# Altium schematic sheet LED fix910 RD 2000278 (4F00224A_7P00494A)_2.SchDoc
size 849 x 241 mm
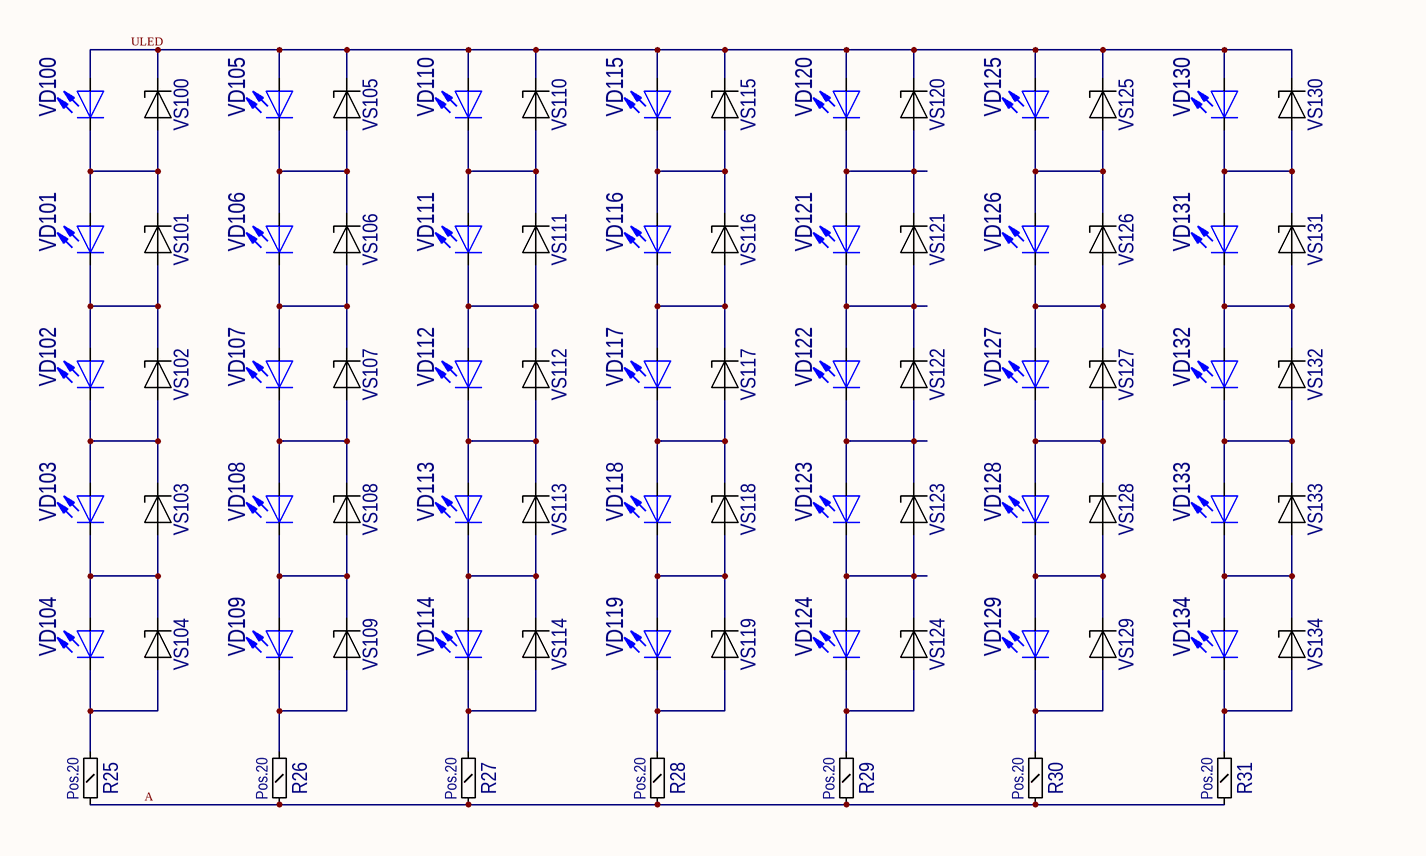
[diagram p0: LED fix910 RD 2000278 (4F00224A_7P00494A)_2.SchDoc, left]
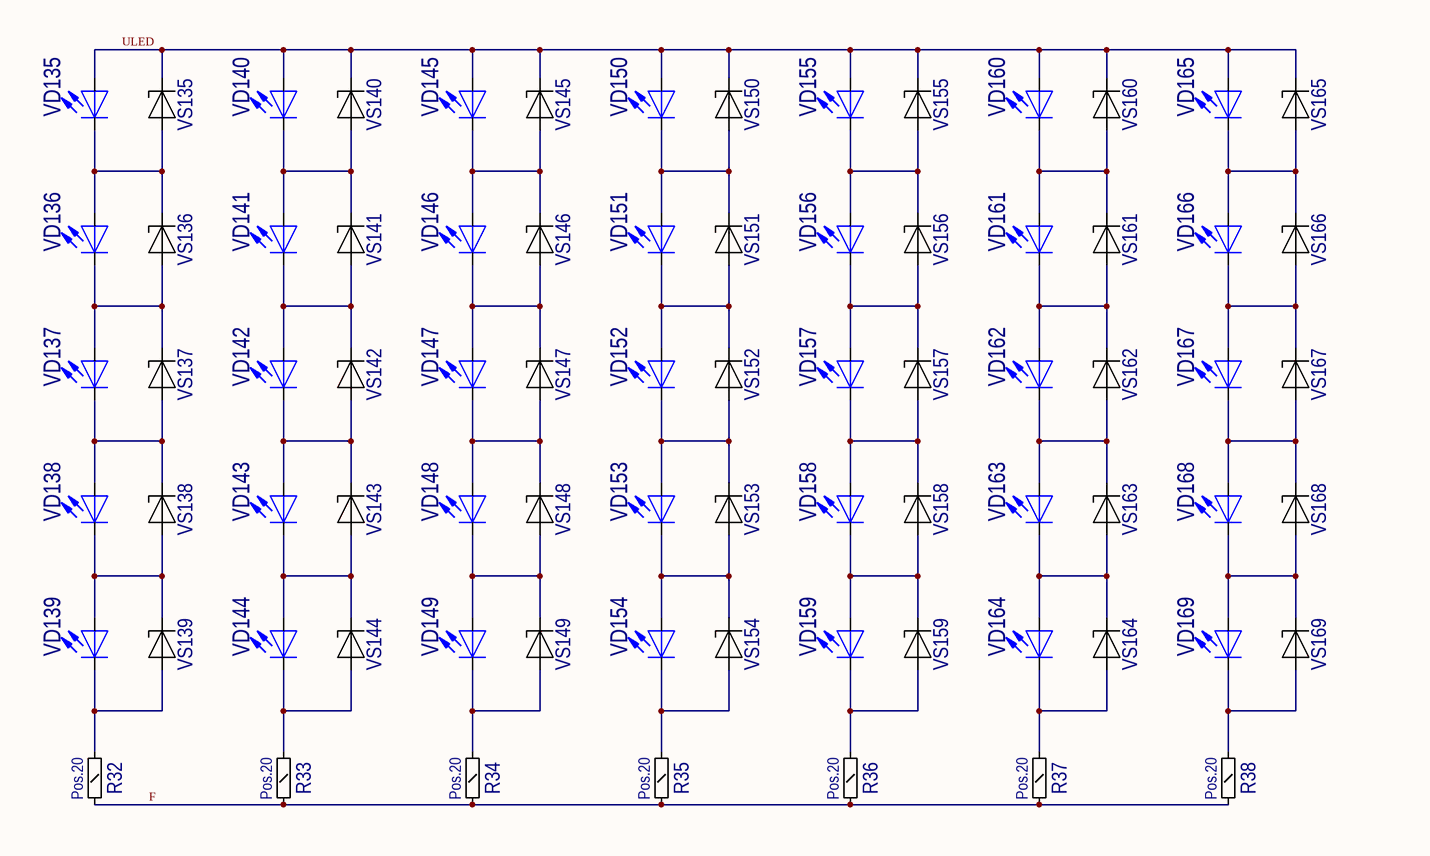
[diagram p1: LED fix910 RD 2000278 (4F00224A_7P00494A)_2.SchDoc, middle]
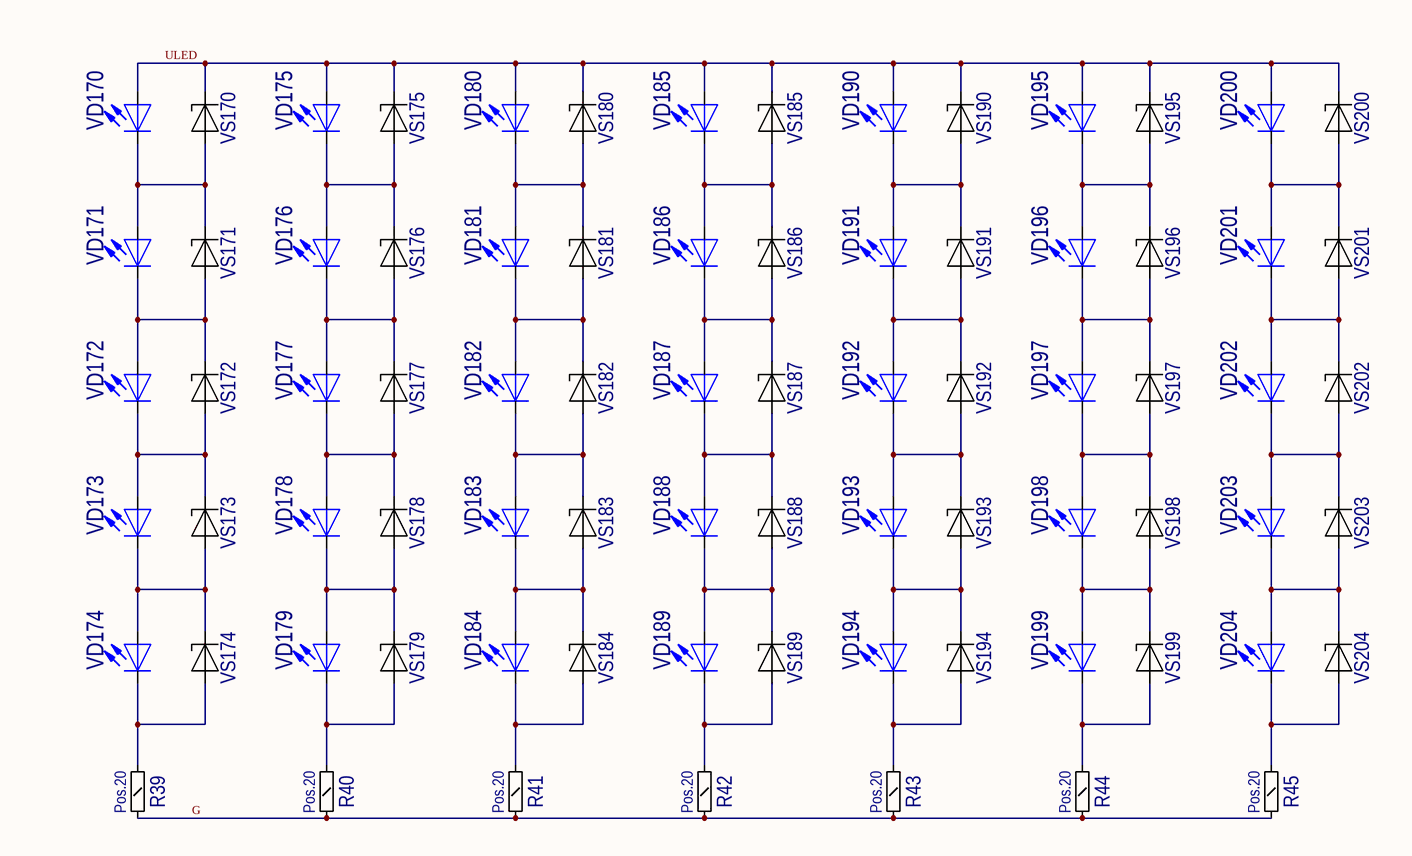
[diagram p2: LED fix910 RD 2000278 (4F00224A_7P00494A)_2.SchDoc, right]

## Parts
R25  value Pos.20  [RC1206S]  (hidden comment: R1206S)
R26  value Pos.20  [RC1206S]  (hidden comment: R1206S)
R27  value Pos.20  [RC1206S]  (hidden comment: R1206S)
R28  value Pos.20  [RC1206S]  (hidden comment: R1206S)
R29  value Pos.20  [RC1206S]  (hidden comment: R1206S)
R30  value Pos.20  [RC1206S]  (hidden comment: R1206S)
R31  value Pos.20  [RC1206S]  (hidden comment: R1206S)
R32  value Pos.20  [RC1206S]  (hidden comment: R1206S)
R33  value Pos.20  [RC1206S]  (hidden comment: R1206S)
R34  value Pos.20  [RC1206S]  (hidden comment: R1206S)
R35  value Pos.20  [RC1206S]  (hidden comment: R1206S)
R36  value Pos.20  [RC1206S]  (hidden comment: R1206S)
R37  value Pos.20  [RC1206S]  (hidden comment: R1206S)
R38  value Pos.20  [RC1206S]  (hidden comment: R1206S)
R39  value Pos.20  [RC1206S]  (hidden comment: R1206S)
R40  value Pos.20  [RC1206S]  (hidden comment: R1206S)
R41  value Pos.20  [RC1206S]  (hidden comment: R1206S)
R42  value Pos.20  [RC1206S]  (hidden comment: R1206S)
R43  value Pos.20  [RC1206S]  (hidden comment: R1206S)
R44  value Pos.20  [RC1206S]  (hidden comment: R1206S)
R45  value Pos.20  [RC1206S]  (hidden comment: R1206S)
VD100  LED, LS E65F-BBDA-1-Z, Red, OSRAM Opto Semiconductors Inc.  [E65F]  (value not drawn)
VD101  LED, LS E65F-BBDA-1-Z, Red, OSRAM Opto Semiconductors Inc.  [E65F]  (value not drawn)
VD102  LED, LS E65F-BBDA-1-Z, Red, OSRAM Opto Semiconductors Inc.  [E65F]  (value not drawn)
VD103  LED, LS E65F-BBDA-1-Z, Red, OSRAM Opto Semiconductors Inc.  [E65F]  (value not drawn)
VD104  LED, LS E65F-BBDA-1-Z, Red, OSRAM Opto Semiconductors Inc.  [E65F]  (value not drawn)
VD105  LED, LS E65F-BBDA-1-Z, Red, OSRAM Opto Semiconductors Inc.  [E65F]  (value not drawn)
VD106  LED, LS E65F-BBDA-1-Z, Red, OSRAM Opto Semiconductors Inc.  [E65F]  (value not drawn)
VD107  LED, LS E65F-BBDA-1-Z, Red, OSRAM Opto Semiconductors Inc.  [E65F]  (value not drawn)
VD108  LED, LS E65F-BBDA-1-Z, Red, OSRAM Opto Semiconductors Inc.  [E65F]  (value not drawn)
VD109  LED, LS E65F-BBDA-1-Z, Red, OSRAM Opto Semiconductors Inc.  [E65F]  (value not drawn)
VD110  LED, LS E65F-BBDA-1-Z, Red, OSRAM Opto Semiconductors Inc.  [E65F]  (value not drawn)
VD111  LED, LS E65F-BBDA-1-Z, Red, OSRAM Opto Semiconductors Inc.  [E65F]  (value not drawn)
VD112  LED, LS E65F-BBDA-1-Z, Red, OSRAM Opto Semiconductors Inc.  [E65F]  (value not drawn)
VD113  LED, LS E65F-BBDA-1-Z, Red, OSRAM Opto Semiconductors Inc.  [E65F]  (value not drawn)
VD114  LED, LS E65F-BBDA-1-Z, Red, OSRAM Opto Semiconductors Inc.  [E65F]  (value not drawn)
VD115  LED, LS E65F-BBDA-1-Z, Red, OSRAM Opto Semiconductors Inc.  [E65F]  (value not drawn)
VD116  LED, LS E65F-BBDA-1-Z, Red, OSRAM Opto Semiconductors Inc.  [E65F]  (value not drawn)
VD117  LED, LS E65F-BBDA-1-Z, Red, OSRAM Opto Semiconductors Inc.  [E65F]  (value not drawn)
VD118  LED, LS E65F-BBDA-1-Z, Red, OSRAM Opto Semiconductors Inc.  [E65F]  (value not drawn)
VD119  LED, LS E65F-BBDA-1-Z, Red, OSRAM Opto Semiconductors Inc.  [E65F]  (value not drawn)
VD120  LED, LS E65F-BBDA-1-Z, Red, OSRAM Opto Semiconductors Inc.  [E65F]  (value not drawn)
VD121  LED, LS E65F-BBDA-1-Z, Red, OSRAM Opto Semiconductors Inc.  [E65F]  (value not drawn)
VD122  LED, LS E65F-BBDA-1-Z, Red, OSRAM Opto Semiconductors Inc.  [E65F]  (value not drawn)
VD123  LED, LS E65F-BBDA-1-Z, Red, OSRAM Opto Semiconductors Inc.  [E65F]  (value not drawn)
VD124  LED, LS E65F-BBDA-1-Z, Red, OSRAM Opto Semiconductors Inc.  [E65F]  (value not drawn)
VD125  LED, LS E65F-BBDA-1-Z, Red, OSRAM Opto Semiconductors Inc.  [E65F]  (value not drawn)
VD126  LED, LS E65F-BBDA-1-Z, Red, OSRAM Opto Semiconductors Inc.  [E65F]  (value not drawn)
VD127  LED, LS E65F-BBDA-1-Z, Red, OSRAM Opto Semiconductors Inc.  [E65F]  (value not drawn)
VD128  LED, LS E65F-BBDA-1-Z, Red, OSRAM Opto Semiconductors Inc.  [E65F]  (value not drawn)
VD129  LED, LS E65F-BBDA-1-Z, Red, OSRAM Opto Semiconductors Inc.  [E65F]  (value not drawn)
VD130  LED, LS E65F-BBDA-1-Z, Red, OSRAM Opto Semiconductors Inc.  [E65F]  (value not drawn)
VD131  LED, LS E65F-BBDA-1-Z, Red, OSRAM Opto Semiconductors Inc.  [E65F]  (value not drawn)
VD132  LED, LS E65F-BBDA-1-Z, Red, OSRAM Opto Semiconductors Inc.  [E65F]  (value not drawn)
VD133  LED, LS E65F-BBDA-1-Z, Red, OSRAM Opto Semiconductors Inc.  [E65F]  (value not drawn)
VD134  LED, LS E65F-BBDA-1-Z, Red, OSRAM Opto Semiconductors Inc.  [E65F]  (value not drawn)
VD135  LED, LS E65F-BBDA-1-Z, Red, OSRAM Opto Semiconductors Inc.  [E65F]  (value not drawn)
VD136  LED, LS E65F-BBDA-1-Z, Red, OSRAM Opto Semiconductors Inc.  [E65F]  (value not drawn)
VD137  LED, LS E65F-BBDA-1-Z, Red, OSRAM Opto Semiconductors Inc.  [E65F]  (value not drawn)
VD138  LED, LS E65F-BBDA-1-Z, Red, OSRAM Opto Semiconductors Inc.  [E65F]  (value not drawn)
VD139  LED, LS E65F-BBDA-1-Z, Red, OSRAM Opto Semiconductors Inc.  [E65F]  (value not drawn)
VD140  LED, LS E65F-BBDA-1-Z, Red, OSRAM Opto Semiconductors Inc.  [E65F]  (value not drawn)
VD141  LED, LS E65F-BBDA-1-Z, Red, OSRAM Opto Semiconductors Inc.  [E65F]  (value not drawn)
VD142  LED, LS E65F-BBDA-1-Z, Red, OSRAM Opto Semiconductors Inc.  [E65F]  (value not drawn)
VD143  LED, LS E65F-BBDA-1-Z, Red, OSRAM Opto Semiconductors Inc.  [E65F]  (value not drawn)
VD144  LED, LS E65F-BBDA-1-Z, Red, OSRAM Opto Semiconductors Inc.  [E65F]  (value not drawn)
VD145  LED, LS E65F-BBDA-1-Z, Red, OSRAM Opto Semiconductors Inc.  [E65F]  (value not drawn)
VD146  LED, LS E65F-BBDA-1-Z, Red, OSRAM Opto Semiconductors Inc.  [E65F]  (value not drawn)
VD147  LED, LS E65F-BBDA-1-Z, Red, OSRAM Opto Semiconductors Inc.  [E65F]  (value not drawn)
VD148  LED, LS E65F-BBDA-1-Z, Red, OSRAM Opto Semiconductors Inc.  [E65F]  (value not drawn)
VD149  LED, LS E65F-BBDA-1-Z, Red, OSRAM Opto Semiconductors Inc.  [E65F]  (value not drawn)
VD150  LED, LS E65F-BBDA-1-Z, Red, OSRAM Opto Semiconductors Inc.  [E65F]  (value not drawn)
VD151  LED, LS E65F-BBDA-1-Z, Red, OSRAM Opto Semiconductors Inc.  [E65F]  (value not drawn)
VD152  LED, LS E65F-BBDA-1-Z, Red, OSRAM Opto Semiconductors Inc.  [E65F]  (value not drawn)
VD153  LED, LS E65F-BBDA-1-Z, Red, OSRAM Opto Semiconductors Inc.  [E65F]  (value not drawn)
VD154  LED, LS E65F-BBDA-1-Z, Red, OSRAM Opto Semiconductors Inc.  [E65F]  (value not drawn)
VD155  LED, LS E65F-BBDA-1-Z, Red, OSRAM Opto Semiconductors Inc.  [E65F]  (value not drawn)
VD156  LED, LS E65F-BBDA-1-Z, Red, OSRAM Opto Semiconductors Inc.  [E65F]  (value not drawn)
VD157  LED, LS E65F-BBDA-1-Z, Red, OSRAM Opto Semiconductors Inc.  [E65F]  (value not drawn)
VD158  LED, LS E65F-BBDA-1-Z, Red, OSRAM Opto Semiconductors Inc.  [E65F]  (value not drawn)
VD159  LED, LS E65F-BBDA-1-Z, Red, OSRAM Opto Semiconductors Inc.  [E65F]  (value not drawn)
VD160  LED, LS E65F-BBDA-1-Z, Red, OSRAM Opto Semiconductors Inc.  [E65F]  (value not drawn)
VD161  LED, LS E65F-BBDA-1-Z, Red, OSRAM Opto Semiconductors Inc.  [E65F]  (value not drawn)
VD162  LED, LS E65F-BBDA-1-Z, Red, OSRAM Opto Semiconductors Inc.  [E65F]  (value not drawn)
VD163  LED, LS E65F-BBDA-1-Z, Red, OSRAM Opto Semiconductors Inc.  [E65F]  (value not drawn)
VD164  LED, LS E65F-BBDA-1-Z, Red, OSRAM Opto Semiconductors Inc.  [E65F]  (value not drawn)
VD165  LED, LS E65F-BBDA-1-Z, Red, OSRAM Opto Semiconductors Inc.  [E65F]  (value not drawn)
VD166  LED, LS E65F-BBDA-1-Z, Red, OSRAM Opto Semiconductors Inc.  [E65F]  (value not drawn)
VD167  LED, LS E65F-BBDA-1-Z, Red, OSRAM Opto Semiconductors Inc.  [E65F]  (value not drawn)
VD168  LED, LS E65F-BBDA-1-Z, Red, OSRAM Opto Semiconductors Inc.  [E65F]  (value not drawn)
VD169  LED, LS E65F-BBDA-1-Z, Red, OSRAM Opto Semiconductors Inc.  [E65F]  (value not drawn)
VD170  LED, LS E65F-BBDA-1-Z, Red, OSRAM Opto Semiconductors Inc.  [E65F]  (value not drawn)
VD171  LED, LS E65F-BBDA-1-Z, Red, OSRAM Opto Semiconductors Inc.  [E65F]  (value not drawn)
VD172  LED, LS E65F-BBDA-1-Z, Red, OSRAM Opto Semiconductors Inc.  [E65F]  (value not drawn)
VD173  LED, LS E65F-BBDA-1-Z, Red, OSRAM Opto Semiconductors Inc.  [E65F]  (value not drawn)
VD174  LED, LS E65F-BBDA-1-Z, Red, OSRAM Opto Semiconductors Inc.  [E65F]  (value not drawn)
VD175  LED, LS E65F-BBDA-1-Z, Red, OSRAM Opto Semiconductors Inc.  [E65F]  (value not drawn)
VD176  LED, LS E65F-BBDA-1-Z, Red, OSRAM Opto Semiconductors Inc.  [E65F]  (value not drawn)
VD177  LED, LS E65F-BBDA-1-Z, Red, OSRAM Opto Semiconductors Inc.  [E65F]  (value not drawn)
VD178  LED, LS E65F-BBDA-1-Z, Red, OSRAM Opto Semiconductors Inc.  [E65F]  (value not drawn)
VD179  LED, LS E65F-BBDA-1-Z, Red, OSRAM Opto Semiconductors Inc.  [E65F]  (value not drawn)
VD180  LED, LS E65F-BBDA-1-Z, Red, OSRAM Opto Semiconductors Inc.  [E65F]  (value not drawn)
VD181  LED, LS E65F-BBDA-1-Z, Red, OSRAM Opto Semiconductors Inc.  [E65F]  (value not drawn)
VD182  LED, LS E65F-BBDA-1-Z, Red, OSRAM Opto Semiconductors Inc.  [E65F]  (value not drawn)
VD183  LED, LS E65F-BBDA-1-Z, Red, OSRAM Opto Semiconductors Inc.  [E65F]  (value not drawn)
VD184  LED, LS E65F-BBDA-1-Z, Red, OSRAM Opto Semiconductors Inc.  [E65F]  (value not drawn)
VD185  LED, LS E65F-BBDA-1-Z, Red, OSRAM Opto Semiconductors Inc.  [E65F]  (value not drawn)
VD186  LED, LS E65F-BBDA-1-Z, Red, OSRAM Opto Semiconductors Inc.  [E65F]  (value not drawn)
VD187  LED, LS E65F-BBDA-1-Z, Red, OSRAM Opto Semiconductors Inc.  [E65F]  (value not drawn)
VD188  LED, LS E65F-BBDA-1-Z, Red, OSRAM Opto Semiconductors Inc.  [E65F]  (value not drawn)
VD189  LED, LS E65F-BBDA-1-Z, Red, OSRAM Opto Semiconductors Inc.  [E65F]  (value not drawn)
VD190  LED, LS E65F-BBDA-1-Z, Red, OSRAM Opto Semiconductors Inc.  [E65F]  (value not drawn)
VD191  LED, LS E65F-BBDA-1-Z, Red, OSRAM Opto Semiconductors Inc.  [E65F]  (value not drawn)
VD192  LED, LS E65F-BBDA-1-Z, Red, OSRAM Opto Semiconductors Inc.  [E65F]  (value not drawn)
VD193  LED, LS E65F-BBDA-1-Z, Red, OSRAM Opto Semiconductors Inc.  [E65F]  (value not drawn)
VD194  LED, LS E65F-BBDA-1-Z, Red, OSRAM Opto Semiconductors Inc.  [E65F]  (value not drawn)
VD195  LED, LS E65F-BBDA-1-Z, Red, OSRAM Opto Semiconductors Inc.  [E65F]  (value not drawn)
VD196  LED, LS E65F-BBDA-1-Z, Red, OSRAM Opto Semiconductors Inc.  [E65F]  (value not drawn)
VD197  LED, LS E65F-BBDA-1-Z, Red, OSRAM Opto Semiconductors Inc.  [E65F]  (value not drawn)
VD198  LED, LS E65F-BBDA-1-Z, Red, OSRAM Opto Semiconductors Inc.  [E65F]  (value not drawn)
VD199  LED, LS E65F-BBDA-1-Z, Red, OSRAM Opto Semiconductors Inc.  [E65F]  (value not drawn)
VD200  LED, LS E65F-BBDA-1-Z, Red, OSRAM Opto Semiconductors Inc.  [E65F]  (value not drawn)
VD201  LED, LS E65F-BBDA-1-Z, Red, OSRAM Opto Semiconductors Inc.  [E65F]  (value not drawn)
VD202  LED, LS E65F-BBDA-1-Z, Red, OSRAM Opto Semiconductors Inc.  [E65F]  (value not drawn)
VD203  LED, LS E65F-BBDA-1-Z, Red, OSRAM Opto Semiconductors Inc.  [E65F]  (value not drawn)
VD204  LED, LS E65F-BBDA-1-Z, Red, OSRAM Opto Semiconductors Inc.  [E65F]  (value not drawn)
VS100  BZX84  [SOT23]  (value not drawn)
VS101  BZX84  [SOT23]  (value not drawn)
VS102  BZX84  [SOT23]  (value not drawn)
VS103  BZX84  [SOT23]  (value not drawn)
VS104  BZX84  [SOT23]  (value not drawn)
VS105  BZX84  [SOT23]  (value not drawn)
VS106  BZX84  [SOT23]  (value not drawn)
VS107  BZX84  [SOT23]  (value not drawn)
VS108  BZX84  [SOT23]  (value not drawn)
VS109  BZX84  [SOT23]  (value not drawn)
VS110  BZX84  [SOT23]  (value not drawn)
VS111  BZX84  [SOT23]  (value not drawn)
VS112  BZX84  [SOT23]  (value not drawn)
VS113  BZX84  [SOT23]  (value not drawn)
VS114  BZX84  [SOT23]  (value not drawn)
VS115  BZX84  [SOT23]  (value not drawn)
VS116  BZX84  [SOT23]  (value not drawn)
VS117  BZX84  [SOT23]  (value not drawn)
VS118  BZX84  [SOT23]  (value not drawn)
VS119  BZX84  [SOT23]  (value not drawn)
VS120  BZX84  [SOT23]  (value not drawn)
VS121  BZX84  [SOT23]  (value not drawn)
VS122  BZX84  [SOT23]  (value not drawn)
VS123  BZX84  [SOT23]  (value not drawn)
VS124  BZX84  [SOT23]  (value not drawn)
VS125  BZX84  [SOT23]  (value not drawn)
VS126  BZX84  [SOT23]  (value not drawn)
VS127  BZX84  [SOT23]  (value not drawn)
VS128  BZX84  [SOT23]  (value not drawn)
VS129  BZX84  [SOT23]  (value not drawn)
VS130  BZX84  [SOT23]  (value not drawn)
VS131  BZX84  [SOT23]  (value not drawn)
VS132  BZX84  [SOT23]  (value not drawn)
VS133  BZX84  [SOT23]  (value not drawn)
VS134  BZX84  [SOT23]  (value not drawn)
VS135  BZX84  [SOT23]  (value not drawn)
VS136  BZX84  [SOT23]  (value not drawn)
VS137  BZX84  [SOT23]  (value not drawn)
VS138  BZX84  [SOT23]  (value not drawn)
VS139  BZX84  [SOT23]  (value not drawn)
VS140  BZX84  [SOT23]  (value not drawn)
VS141  BZX84  [SOT23]  (value not drawn)
VS142  BZX84  [SOT23]  (value not drawn)
VS143  BZX84  [SOT23]  (value not drawn)
VS144  BZX84  [SOT23]  (value not drawn)
VS145  BZX84  [SOT23]  (value not drawn)
VS146  BZX84  [SOT23]  (value not drawn)
VS147  BZX84  [SOT23]  (value not drawn)
VS148  BZX84  [SOT23]  (value not drawn)
VS149  BZX84  [SOT23]  (value not drawn)
VS150  BZX84  [SOT23]  (value not drawn)
VS151  BZX84  [SOT23]  (value not drawn)
VS152  BZX84  [SOT23]  (value not drawn)
VS153  BZX84  [SOT23]  (value not drawn)
VS154  BZX84  [SOT23]  (value not drawn)
VS155  BZX84  [SOT23]  (value not drawn)
VS156  BZX84  [SOT23]  (value not drawn)
VS157  BZX84  [SOT23]  (value not drawn)
VS158  BZX84  [SOT23]  (value not drawn)
VS159  BZX84  [SOT23]  (value not drawn)
VS160  BZX84  [SOT23]  (value not drawn)
VS161  BZX84  [SOT23]  (value not drawn)
VS162  BZX84  [SOT23]  (value not drawn)
VS163  BZX84  [SOT23]  (value not drawn)
VS164  BZX84  [SOT23]  (value not drawn)
VS165  BZX84  [SOT23]  (value not drawn)
VS166  BZX84  [SOT23]  (value not drawn)
VS167  BZX84  [SOT23]  (value not drawn)
VS168  BZX84  [SOT23]  (value not drawn)
VS169  BZX84  [SOT23]  (value not drawn)
VS170  BZX84  [SOT23]  (value not drawn)
VS171  BZX84  [SOT23]  (value not drawn)
VS172  BZX84  [SOT23]  (value not drawn)
VS173  BZX84  [SOT23]  (value not drawn)
VS174  BZX84  [SOT23]  (value not drawn)
VS175  BZX84  [SOT23]  (value not drawn)
VS176  BZX84  [SOT23]  (value not drawn)
VS177  BZX84  [SOT23]  (value not drawn)
VS178  BZX84  [SOT23]  (value not drawn)
VS179  BZX84  [SOT23]  (value not drawn)
VS180  BZX84  [SOT23]  (value not drawn)
VS181  BZX84  [SOT23]  (value not drawn)
VS182  BZX84  [SOT23]  (value not drawn)
VS183  BZX84  [SOT23]  (value not drawn)
VS184  BZX84  [SOT23]  (value not drawn)
VS185  BZX84  [SOT23]  (value not drawn)
VS186  BZX84  [SOT23]  (value not drawn)
VS187  BZX84  [SOT23]  (value not drawn)
VS188  BZX84  [SOT23]  (value not drawn)
VS189  BZX84  [SOT23]  (value not drawn)
VS190  BZX84  [SOT23]  (value not drawn)
VS191  BZX84  [SOT23]  (value not drawn)
VS192  BZX84  [SOT23]  (value not drawn)
VS193  BZX84  [SOT23]  (value not drawn)
VS194  BZX84  [SOT23]  (value not drawn)
VS195  BZX84  [SOT23]  (value not drawn)
VS196  BZX84  [SOT23]  (value not drawn)
VS197  BZX84  [SOT23]  (value not drawn)
VS198  BZX84  [SOT23]  (value not drawn)
VS199  BZX84  [SOT23]  (value not drawn)
VS200  BZX84  [SOT23]  (value not drawn)
VS201  BZX84  [SOT23]  (value not drawn)
VS202  BZX84  [SOT23]  (value not drawn)
VS203  BZX84  [SOT23]  (value not drawn)
VS204  BZX84  [SOT23]  (value not drawn)

## Nets
A: R25.2 R26.2 R27.2 R28.2 R29.2 R30.2 R31.2
F: R32.2 R33.2 R34.2 R35.2 R36.2 R37.2 R38.2
G: R39.2 R40.2 R41.2 R42.2 R43.2 R44.2 R45.2
ULED: VD100.2(A) VD105.2(A) VD110.2(A) VD115.2(A) VD120.2(A) VD125.2(A) VD130.2(A) VD135.2(A) VD140.2(A) VD145.2(A) VD150.2(A) VD155.2(A) VD160.2(A) VD165.2(A) VD170.2(A) VD175.2(A) VD180.2(A) VD185.2(A) VD190.2(A) VD195.2(A) VD200.2(A) VS100.3 VS105.3 VS110.3 VS115.3 VS120.3 VS125.3 VS130.3 VS135.3 VS140.3 VS145.3 VS150.3 VS155.3 VS160.3 VS165.3 VS170.3 VS175.3 VS180.3 VS185.3 VS190.3 VS195.3 VS200.3
NetR25_1: R25.1 VD104.1(K) VS104.1
NetR26_1: R26.1 VD109.1(K) VS109.1
NetR27_1: R27.1 VD114.1(K) VS114.1
NetR28_1: R28.1 VD119.1(K) VS119.1
NetR29_1: R29.1 VD124.1(K) VS124.1
NetR30_1: R30.1 VD129.1(K) VS129.1
NetR31_1: R31.1 VD134.1(K) VS134.1
NetR32_1: R32.1 VD139.1(K) VS139.1
NetR33_1: R33.1 VD144.1(K) VS144.1
NetR34_1: R34.1 VD149.1(K) VS149.1
NetR35_1: R35.1 VD154.1(K) VS154.1
NetR36_1: R36.1 VD159.1(K) VS159.1
NetR37_1: R37.1 VD164.1(K) VS164.1
NetR38_1: R38.1 VD169.1(K) VS169.1
NetR39_1: R39.1 VD174.1(K) VS174.1
NetR40_1: R40.1 VD179.1(K) VS179.1
NetR41_1: R41.1 VD184.1(K) VS184.1
NetR42_1: R42.1 VD189.1(K) VS189.1
NetR43_1: R43.1 VD194.1(K) VS194.1
NetR44_1: R44.1 VD199.1(K) VS199.1
NetR45_1: R45.1 VD204.1(K) VS204.1
NetVD100_1: VD100.1(K) VD101.2(A) VS100.1 VS101.3
NetVD101_1: VD101.1(K) VD102.2(A) VS101.1 VS102.3
NetVD102_1: VD102.1(K) VD103.2(A) VS102.1 VS103.3
NetVD103_1: VD103.1(K) VD104.2(A) VS103.1 VS104.3
NetVD105_1: VD105.1(K) VD106.2(A) VS105.1 VS106.3
NetVD106_1: VD106.1(K) VD107.2(A) VS106.1 VS107.3
NetVD107_1: VD107.1(K) VD108.2(A) VS107.1 VS108.3
NetVD108_1: VD108.1(K) VD109.2(A) VS108.1 VS109.3
NetVD110_1: VD110.1(K) VD111.2(A) VS110.1 VS111.3
NetVD111_1: VD111.1(K) VD112.2(A) VS111.1 VS112.3
NetVD112_1: VD112.1(K) VD113.2(A) VS112.1 VS113.3
NetVD113_1: VD113.1(K) VD114.2(A) VS113.1 VS114.3
NetVD115_1: VD115.1(K) VD116.2(A) VS115.1 VS116.3
NetVD116_1: VD116.1(K) VD117.2(A) VS116.1 VS117.3
NetVD117_1: VD117.1(K) VD118.2(A) VS117.1 VS118.3
NetVD118_1: VD118.1(K) VD119.2(A) VS118.1 VS119.3
NetVD120_1: VD120.1(K) VD121.2(A) VS120.1 VS121.3
NetVD121_1: VD121.1(K) VD122.2(A) VS121.1 VS122.3
NetVD122_1: VD122.1(K) VD123.2(A) VS122.1 VS123.3
NetVD123_1: VD123.1(K) VD124.2(A) VS123.1 VS124.3
NetVD125_1: VD125.1(K) VD126.2(A) VS125.1 VS126.3
NetVD126_1: VD126.1(K) VD127.2(A) VS126.1 VS127.3
NetVD127_1: VD127.1(K) VD128.2(A) VS127.1 VS128.3
NetVD128_1: VD128.1(K) VD129.2(A) VS128.1 VS129.3
NetVD130_1: VD130.1(K) VD131.2(A) VS130.1 VS131.3
NetVD131_1: VD131.1(K) VD132.2(A) VS131.1 VS132.3
NetVD132_1: VD132.1(K) VD133.2(A) VS132.1 VS133.3
NetVD133_1: VD133.1(K) VD134.2(A) VS133.1 VS134.3
NetVD135_1: VD135.1(K) VD136.2(A) VS135.1 VS136.3
NetVD136_1: VD136.1(K) VD137.2(A) VS136.1 VS137.3
NetVD137_1: VD137.1(K) VD138.2(A) VS137.1 VS138.3
NetVD138_1: VD138.1(K) VD139.2(A) VS138.1 VS139.3
NetVD140_1: VD140.1(K) VD141.2(A) VS140.1 VS141.3
NetVD141_1: VD141.1(K) VD142.2(A) VS141.1 VS142.3
NetVD142_1: VD142.1(K) VD143.2(A) VS142.1 VS143.3
NetVD143_1: VD143.1(K) VD144.2(A) VS143.1 VS144.3
NetVD145_1: VD145.1(K) VD146.2(A) VS145.1 VS146.3
NetVD146_1: VD146.1(K) VD147.2(A) VS146.1 VS147.3
NetVD147_1: VD147.1(K) VD148.2(A) VS147.1 VS148.3
NetVD148_1: VD148.1(K) VD149.2(A) VS148.1 VS149.3
NetVD150_1: VD150.1(K) VD151.2(A) VS150.1 VS151.3
NetVD151_1: VD151.1(K) VD152.2(A) VS151.1 VS152.3
NetVD152_1: VD152.1(K) VD153.2(A) VS152.1 VS153.3
NetVD153_1: VD153.1(K) VD154.2(A) VS153.1 VS154.3
NetVD155_1: VD155.1(K) VD156.2(A) VS155.1 VS156.3
NetVD156_1: VD156.1(K) VD157.2(A) VS156.1 VS157.3
NetVD157_1: VD157.1(K) VD158.2(A) VS157.1 VS158.3
NetVD158_1: VD158.1(K) VD159.2(A) VS158.1 VS159.3
NetVD160_1: VD160.1(K) VD161.2(A) VS160.1 VS161.3
NetVD161_1: VD161.1(K) VD162.2(A) VS161.1 VS162.3
NetVD162_1: VD162.1(K) VD163.2(A) VS162.1 VS163.3
NetVD163_1: VD163.1(K) VD164.2(A) VS163.1 VS164.3
NetVD165_1: VD165.1(K) VD166.2(A) VS165.1 VS166.3
NetVD166_1: VD166.1(K) VD167.2(A) VS166.1 VS167.3
NetVD167_1: VD167.1(K) VD168.2(A) VS167.1 VS168.3
NetVD168_1: VD168.1(K) VD169.2(A) VS168.1 VS169.3
NetVD170_1: VD170.1(K) VD171.2(A) VS170.1 VS171.3
NetVD171_1: VD171.1(K) VD172.2(A) VS171.1 VS172.3
NetVD172_1: VD172.1(K) VD173.2(A) VS172.1 VS173.3
NetVD173_1: VD173.1(K) VD174.2(A) VS173.1 VS174.3
NetVD175_1: VD175.1(K) VD176.2(A) VS175.1 VS176.3
NetVD176_1: VD176.1(K) VD177.2(A) VS176.1 VS177.3
NetVD177_1: VD177.1(K) VD178.2(A) VS177.1 VS178.3
NetVD178_1: VD178.1(K) VD179.2(A) VS178.1 VS179.3
NetVD180_1: VD180.1(K) VD181.2(A) VS180.1 VS181.3
NetVD181_1: VD181.1(K) VD182.2(A) VS181.1 VS182.3
NetVD182_1: VD182.1(K) VD183.2(A) VS182.1 VS183.3
NetVD183_1: VD183.1(K) VD184.2(A) VS183.1 VS184.3
NetVD185_1: VD185.1(K) VD186.2(A) VS185.1 VS186.3
NetVD186_1: VD186.1(K) VD187.2(A) VS186.1 VS187.3
NetVD187_1: VD187.1(K) VD188.2(A) VS187.1 VS188.3
NetVD188_1: VD188.1(K) VD189.2(A) VS188.1 VS189.3
NetVD190_1: VD190.1(K) VD191.2(A) VS190.1 VS191.3
NetVD191_1: VD191.1(K) VD192.2(A) VS191.1 VS192.3
NetVD192_1: VD192.1(K) VD193.2(A) VS192.1 VS193.3
NetVD193_1: VD193.1(K) VD194.2(A) VS193.1 VS194.3
NetVD195_1: VD195.1(K) VD196.2(A) VS195.1 VS196.3
NetVD196_1: VD196.1(K) VD197.2(A) VS196.1 VS197.3
NetVD197_1: VD197.1(K) VD198.2(A) VS197.1 VS198.3
NetVD198_1: VD198.1(K) VD199.2(A) VS198.1 VS199.3
NetVD200_1: VD200.1(K) VD201.2(A) VS200.1 VS201.3
NetVD201_1: VD201.1(K) VD202.2(A) VS201.1 VS202.3
NetVD202_1: VD202.1(K) VD203.2(A) VS202.1 VS203.3
NetVD203_1: VD203.1(K) VD204.2(A) VS203.1 VS204.3

Not connected (* = marked no-connect by the designer): VS100 2; VS101 2; VS102 2; VS103 2; VS104 2; VS105 2; VS106 2; VS107 2; VS108 2; VS109 2; VS110 2; VS111 2; VS112 2; VS113 2; VS114 2; VS115 2; VS116 2; VS117 2; VS118 2; VS119 2; VS120 2; VS121 2; VS122 2; VS123 2; VS124 2; VS125 2; VS126 2; VS127 2; VS128 2; VS129 2; VS130 2; VS131 2; VS132 2; VS133 2; VS134 2; VS135 2; VS136 2; VS137 2; VS138 2; VS139 2; VS140 2; VS141 2; VS142 2; VS143 2; VS144 2; VS145 2; VS146 2; VS147 2; VS148 2; VS149 2; VS150 2; VS151 2; VS152 2; VS153 2; VS154 2; VS155 2; VS156 2; VS157 2; VS158 2; VS159 2; VS160 2; VS161 2; VS162 2; VS163 2; VS164 2; VS165 2; VS166 2; VS167 2; VS168 2; VS169 2; VS170 2; VS171 2; VS172 2; VS173 2; VS174 2; VS175 2; VS176 2; VS177 2; VS178 2; VS179 2; VS180 2; VS181 2; VS182 2; VS183 2; VS184 2; VS185 2; VS186 2; VS187 2; VS188 2; VS189 2; VS190 2; VS191 2; VS192 2; VS193 2; VS194 2; VS195 2; VS196 2; VS197 2; VS198 2; VS199 2; VS200 2; VS201 2; VS202 2; VS203 2; VS204 2

## Library data of the parts
VD100-VD204 = 4176: idComponent: 4176; Jofre_PN: HL1032; Component_Group: Diodes; Tech_Specification: LED Chip, LS E65F-BBDA-1-Z, Red, 633nm, 3920mcd, 60 deg, 2,15V, 50 mA, -40°C...+85°C, PLCC-4, OSRAM Opto Semiconductors Inc.; Mounting_Type: SMD; Operating_Temperature: -40°C...+85°C; Notes: price Digi-Key @2.000; User: ke-sta@kd-sta; Value: LS E65F-BBDA-1-Z; Component_Type: LED; Package: PLCC-4; Marking_Code: -; Manufacturer: OSRAM Opto Semiconductors Inc.; Manufacturer_PN: LS E65F-BBDA-1-Z; ComponentLink1Description: Datasheet; ComponentLink1URL: https://media.digikey.com/pdf/Data%20Sheets/Osram%20PDFs/LS_E65F_Rev1.2.pdf; Price_EUR: 0,15835; Status: Unchecked; Date_of_Update: 12.11.2018 13:55:11; Date_of_Creation: 30.10.2018 19:15:38
VS100-VS204 = BZX84: OriginalName: DIODE; Value: *